# Altium schematic sheet SoilMoisture.SchDoc
size A
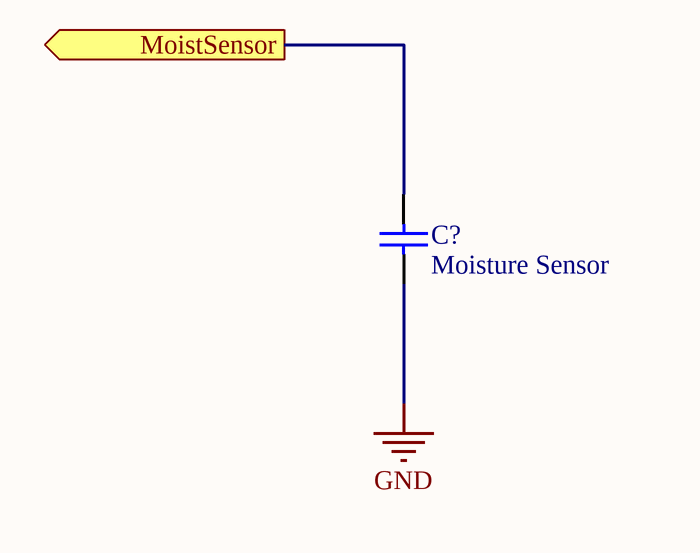
[diagram p0: SoilMoisture.SchDoc]

## Parts
C?  Moisture Sensor  [RAD-0.3]

## Ports
MoistSensor (out)

## Nets
GND: C?.1
MoistSensor: C?.2 ; port MoistSensor

## Library data of the parts
C? = Cap: Capacitor; Value: 100pF; Published: 8-Jun-2000; LatestRevisionDate: 17-Jul-2002; LatestRevisionNote: Re-released for DXP Platform.; PackageReference: RAD-0.3; Publisher: Altium Limited; PackageDescription: Radial Cap, Thru-Hole; 2 Leads; 0.3 in Pin Spacing